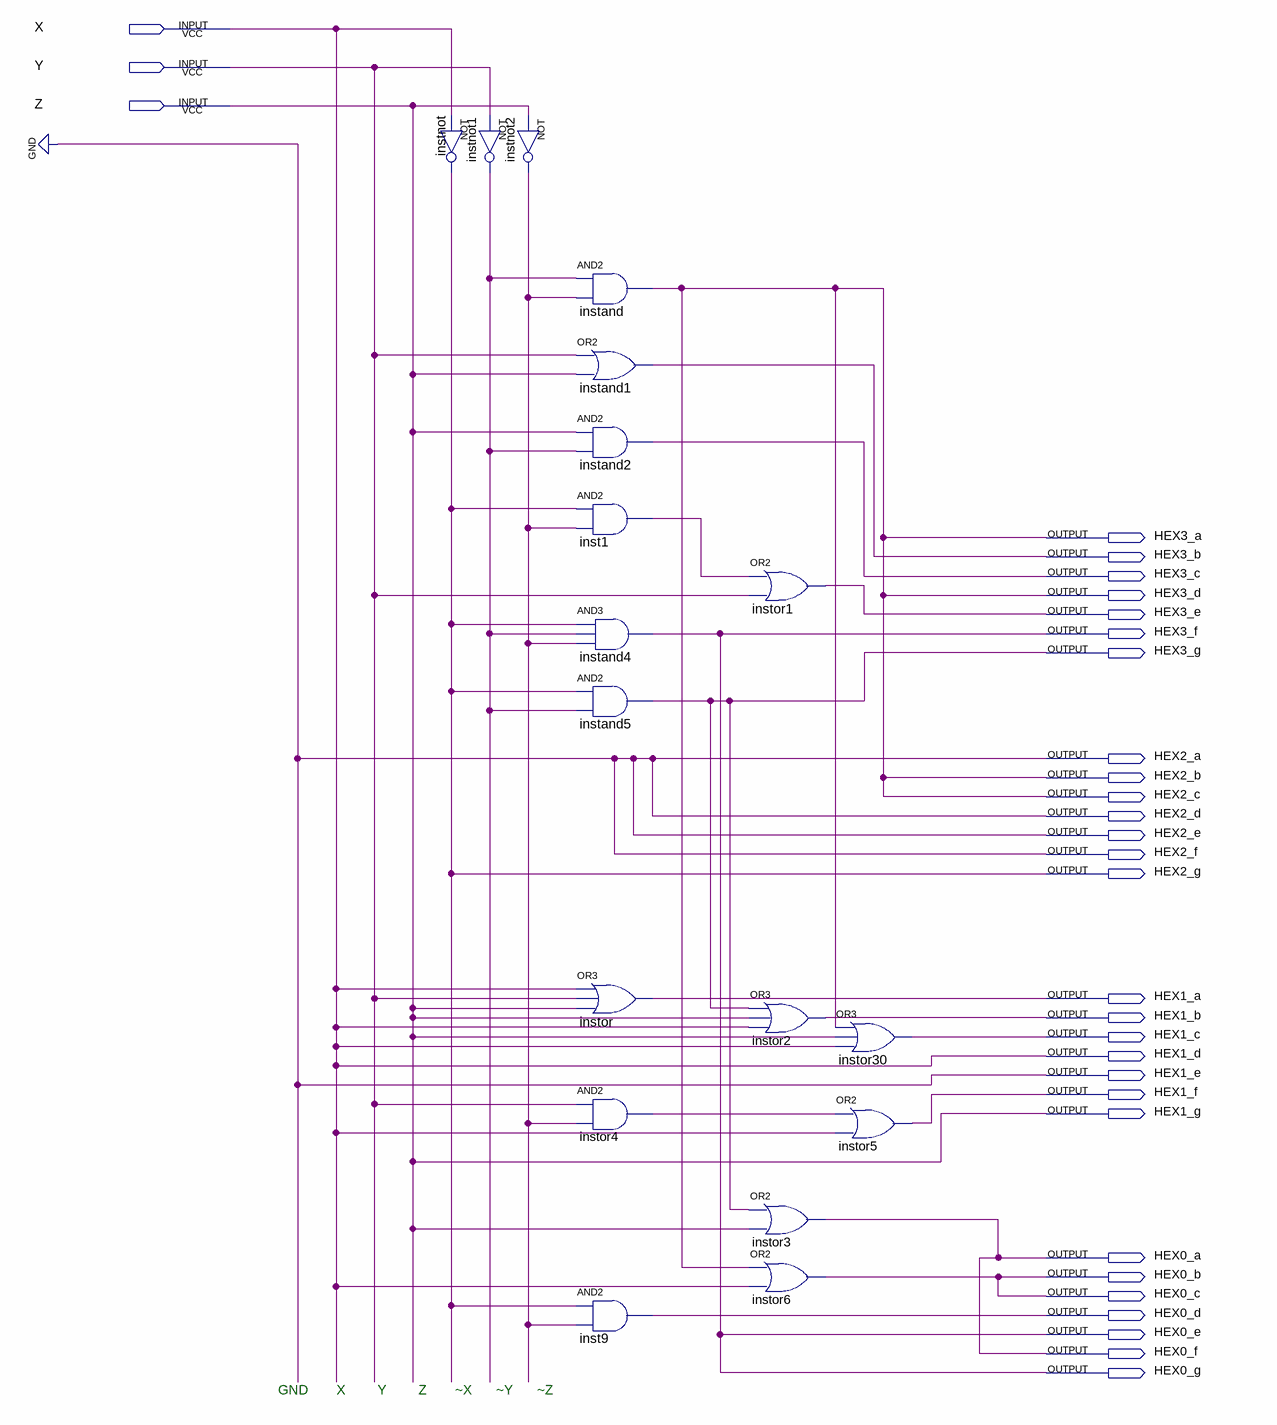
[diagram p0: schematic sheet]
// Quartus schematic Lab8.bdf as structural Verilog: 18 symbols, 31 pins
module Lab8 (
  input  X,
  input  Y,
  input  Z,
  output HEX3_a,
  output HEX3_b,
  output HEX3_c,
  output HEX3_d,
  output HEX3_e,
  output HEX3_f,
  output HEX3_g,
  output HEX2_a,
  output HEX2_b,
  output HEX2_c,
  output HEX2_d,
  output HEX2_e,
  output HEX2_f,
  output HEX2_g,
  output HEX1_a,
  output HEX1_b,
  output HEX1_c,
  output HEX1_d,
  output HEX1_e,
  output HEX1_f,
  output HEX1_g,
  output HEX0_a,
  output HEX0_b,
  output HEX0_c,
  output HEX0_d,
  output HEX0_e,
  output HEX0_f,
  output HEX0_g
);

  wire inst1_out, instnot1_out, instnot2_out, instor4_out;

  not instnot (HEX2_g, X);
  not instnot1 (instnot1_out, Y);
  not instnot2 (instnot2_out, Z);
  and instand (HEX2_b, instnot1_out, instnot2_out);
  or instand1 (HEX3_b, Y, Z);
  and instand2 (HEX3_c, Z, instnot1_out);
  and inst1 (inst1_out, HEX2_g, instnot2_out);
  and instand4 (HEX0_e, HEX2_g, instnot1_out, instnot2_out);
  and instand5 (HEX3_g, HEX2_g, instnot1_out);
  or instor (HEX1_a, X, Y, Z);
  and instor4 (instor4_out, Y, instnot2_out);
  and inst9 (HEX0_d, HEX2_g, instnot2_out);
  or instor1 (HEX3_e, inst1_out, Y);
  or instor2 (HEX1_b, HEX3_g, Z, X);
  or instor3 (HEX0_a, HEX3_g, Z);
  or instor6 (HEX0_b, HEX2_b, X);
  or instor30 (HEX1_c, HEX2_b, Z, X);
  or instor5 (HEX1_f, instor4_out, X);

  assign HEX0_c = HEX0_b;
  assign HEX0_f = HEX0_a;
  assign HEX0_g = HEX0_e;
  assign HEX1_d = X;
  assign HEX1_e = 1'b0;
  assign HEX1_g = Z;
  assign HEX2_a = 1'b0;
  assign HEX2_c = HEX2_b;
  assign HEX2_d = 1'b0;
  assign HEX2_e = 1'b0;
  assign HEX2_f = 1'b0;
  assign HEX3_a = HEX2_b;
  assign HEX3_d = HEX2_b;
  assign HEX3_f = HEX0_e;

  // Notes on the sheet:
  //   GND       X        Y        Z       ~X      ~Y      ~Z
endmodule
